# EAGLE design circuit (EAGLE 7.1.0)
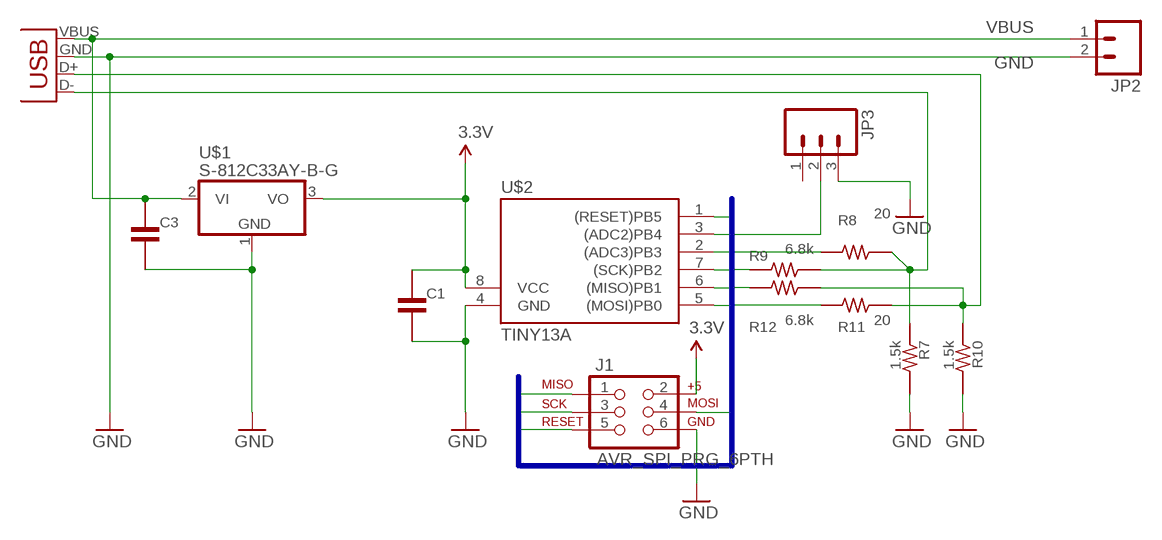
[diagram p0: schematic, sheet 1]

## Parts
C1  C-50V-0302-2.54  [50-0302-2.54]
C3  C-50V-0302-2.54  [50-0302-2.54]
J1  AVR_SPI_PRG_6PTH  [2X3]
JP1  USB-A-H  [USB-A-H]
JP2  M02PTH  [1X02]
JP3  M03PTH  [1X03]
R7  1.5k  R-1/4W-05.08-V  [1/4W-5.08V]
R8  20  R-1/4W-05.08-V  [1/4W-5.08V]
R9  6.8k  R-1/4W-05.08-V  [1/4W-5.08V]
R10  1.5k  R-1/4W-05.08-V  [1/4W-5.08V]
R11  20  R-1/4W-05.08-V  [1/4W-5.08V]
R12  6.8k  R-1/4W-05.08-V  [1/4W-5.08V]
U$1  S-812C33AY-B-G  S-812C  [TO-92]
U$2  TINY13A  TINY138P3  [DIL08]

## Nets
0.6V2: JP1.D-(D+) R7.PAD1 R8.PAD2 R9.PAD2
0.6V3: JP1.D+(D-) R10.PAD1 R11.PAD2 R12.PAD2
3.3V: C1.PAD1 J1.2 U$1.3(VO) U$2.8(VCC)
GND: C1.PAD2 C3.PAD2 J1.6 JP1.GND(VBUS) JP2.2 JP3.3 R7.PAD2 R10.PAD2 U$1.1(GND) U$2.4(GND)
MISO: J1.1 R12.PAD1 U$2.6((MISO)PB1)
MOSI: J1.4 R11.PAD1 U$2.5((MOSI)PB0)
N$1: R8.PAD1 U$2.2((ADC3)PB3)
N$2: JP3.2 U$2.3((ADC2)PB4)
RESET: J1.5 U$2.1((RESET)PB5)
SCK: J1.3 R9.PAD1 U$2.7((SCK)PB2)
VBUS: C3.PAD1 JP1.VBUS(GND) JP2.1 U$1.2(VI)
Unconnected: JP3.1

## Buses
MISO,SCK,RESET,MOSI

## Library data of the parts
C1 C3 = my:C-: CAPACITOR Japanese symbol
J1 = SparkFun-Connectors:AVR_SPI_PRG_6: AVR ISP 6 Pin This is the reduced ISP connector for AVR programming. Common on Arduino. This footprint will take up less PCB space and can be used with a 10-pin to 6-pin adapter such as SKU: BOB-08508
JP1 = SparkFun-Connectors:USB: USB Connectors USB-B-PTH is fully proven SKU : PRT-00139/CONN-08278 USB-miniB is fully proven SKU : PRT-00587 USB-A-PCB is untested. USB-A-H is throughly reviewed, but untested. Spark Fun Electronics SKU : PRT-00437 USB-B-SMT is throughly reviewed, but untested. Needs silkscreen touching up. USB-A-S has not been used/tested USB-MB-H has not been used/tested USB-MICROB has been used. CONN-09505
JP2 = SparkFun-Connectors:M02: Header 2 Standard 2-pin 0.1" header. Use with straight break away headers (SKU : PRT-00116), right angle break away headers (PRT-00553), swiss pins (PRT-00743), machine pins (PRT-00117), and female headers (PRT-00115). Molex polarized connector foot print use with SKU : PRT-08233 with associated crimp pins and housings.
JP3 = SparkFun-Connectors:M03: Header 3 Standard 3-pin 0.1" header. Use with straight break away headers (SKU : PRT-00116), right angle break away headers (PRT-00553), swiss pins (PRT-00743), machine pins (PRT-00117), and female headers (PRT-00115). Molex polarized connector foot print use with SKU : PRT-08232 with associated crimp pins and housings.
R7-R12 = my:R-: RESISTOR Japanese symbol
U$1 = my:S-812C
U$2 = avr-7:TINY13*

## Board
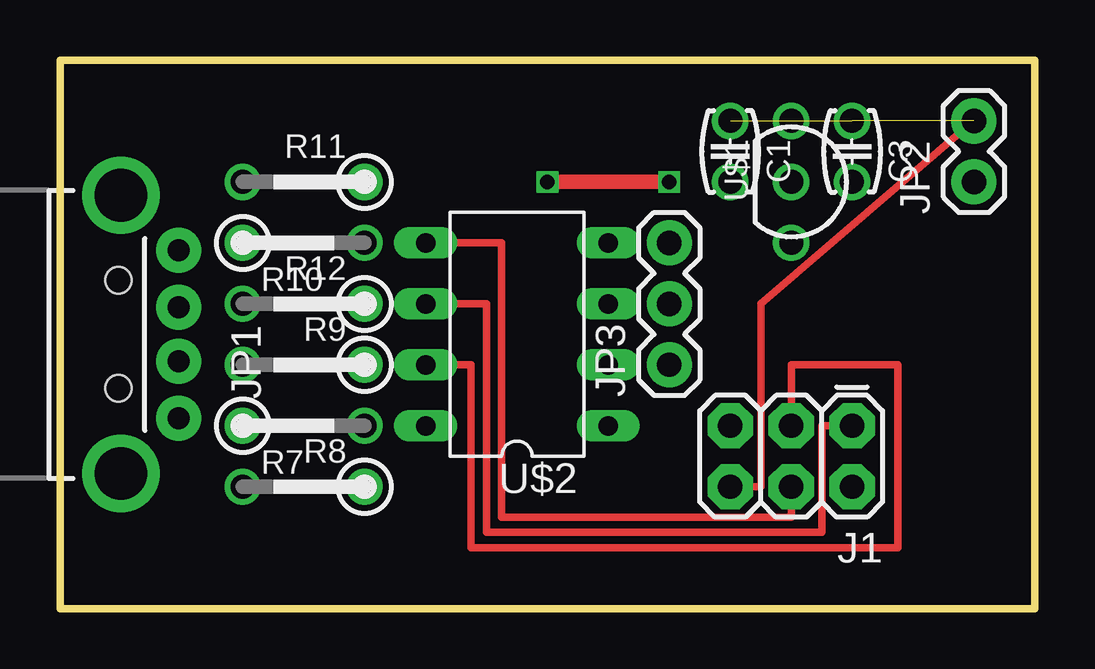
[diagram p1: board, top side]
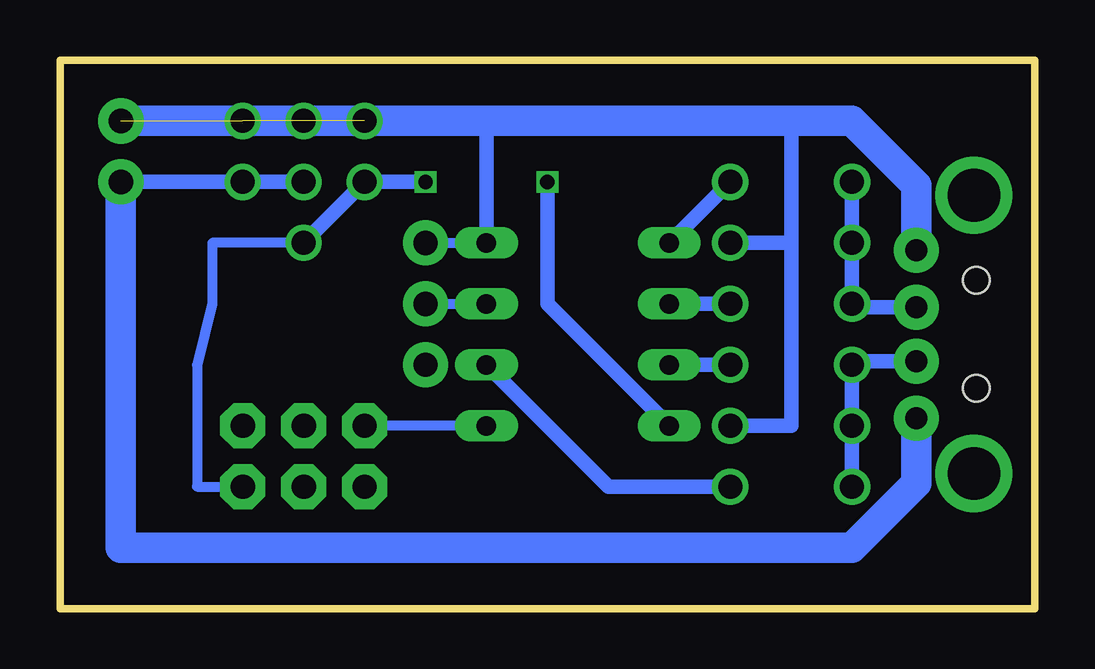
[diagram p2: board, bottom side, seen from below]

Size 40.64 x 22.86 mm. Coordinates in mm from the lower left corner, seen from the top.
Outline: 0,0 40.64,0 40.64,22.86 0,22.86 0,0
Copper layers (1*16): Top 0.035mm / dielectric 1.5mm / Bottom 0.035mm
Design rules "Elecrow_2-layer_eagle_rule": minimum track width 6mil, minimum drill 12mil, track to track 6mil, track to pad 6mil, pad to pad 6mil, via to via 6mil, smd to smd 0mil, copper to edge 10mil, drill to drill 10mil, minimum pad ring 10mil, minimum via ring 6mil, stop-mask expansion 2mil, vias tented up to drill 100mil, thermal gap 10mil

### Footprints (pad centres in the part's own frame; a part is rotated, then mirrored left to right if it is on the bottom)
50-0302-2.54 = drill 1: PAD1 -1.27,0; PAD2 1.27,0
2X3 = drill 1.016 pad 1.88 octagon: 1 0,0; 2 0,2.54; 3 2.54,0; 4 2.54,2.54; 5 5.08,0; 6 5.08,2.54
USB-A-H = drill 0.914 pad 1.88: D+ 2.4,1.127; D- 2.4,-1.127; GND 2.4,3.5; VBUS 2.4,-3.5 | drill 2.2: GND2 0,-5.8; GND3 0,5.8 | hole 1.1: -0.1,2.25; -0.1,-2.25
1X02 = drill 1.016 pad 1.88: 1 0,0; 2 2.54,0
1X03 = drill 1.016 pad 1.88: 1 0,0; 2 2.54,0; 3 5.08,0
1/4W-5.08V = drill 1: PAD1 0,0; PAD2 5.08,0
TO-92 = drill 1: 1 -2.54,0; 2 0,0; 3 2.54,0
DIL08 = drill 0.813 long: 1 -3.81,-3.81; 2 -1.27,-3.81; 3 1.27,-3.81; 4 3.81,-3.81; 5 3.81,3.81; 6 1.27,3.81; 7 -1.27,3.81; 8 -3.81,3.81

### Placement (x,y rotation side)
C1  27.94,19.05 90 top
C3  33.02,19.05 90 top
J1  33.02,7.62 180 top
JP1  2.54,11.43 0 top
JP2  38.1,17.78 90 top
JP3  25.4,10.16 90 top
R7  7.62,7.62 0 top
R8  12.7,5.08 180 top
R9  12.7,10.16 180 top
R10  7.62,15.24 0 top
R11  12.7,17.78 180 top
R12  12.7,12.7 180 top
U$1  30.48,17.78 270 top
U$2  19.05,11.43 90 top

### Tracks (layer width: path | path; a pad name or v marks a point on that pad's centre or on a via)
0.6V2
  Bottom 0.61: R8.PAD2 R7.PAD1 R9.PAD2 7.48,10.3 JP1.D-
0.6V3
  Bottom 0.61: R11.PAD2 R10.PAD1 R12.PAD2 7.48,12.56 JP1.D+
3.3V  (via drill 0.6)
  Top 0.61: v25.4,17.78 v20.32,17.78
  Bottom 0.406: U$1.3 34.29,15.24 34.29,12.7 34.92,10.16 34.92,5.08 J1.2
  Bottom 0.61: U$2.8 20.32,12.7 v20.32,17.78 | U$1.3 C1.PAD1 v25.4,17.78
GND  (via drill 0.6)  (3 unrouted)
  Top 0.305: J1.6 29.21,5.08 29.21,12.7 JP2.2
  Bottom 0.406: JP3.3 U$2.4
  Bottom 0.61: R7.PAD2 10.16,7.62 10.16,15.24 | 10.16,15.24 R10.PAD2 | 10.16,20.32 10.16,15.24 | U$2.4 22.86,20.32
  Bottom 1.27: JP1.GND 4.94,17.64 7.62,20.32 10.16,20.32 22.86,20.32 JP2.2
  other vias: 38.1,20.32
MISO
  Top 0.305: U$2.6 17.78,12.7 17.78,3.17 31.75,3.17 31.75,7.62 J1.1
  Bottom 0.61: R12.PAD1 U$2.6
MOSI
  Top 0.305: U$2.5 18.41,15.24 18.41,3.81 30.48,3.81 J1.4
  Bottom 0.61: R11.PAD1 U$2.5
N$1
  Bottom 0.61: R8.PAD1 17.78,5.08 U$2.2
N$2
  Bottom 0.406: JP3.2 U$2.3
RESET
  Bottom 0.406: U$2.1 J1.5
SCK
  Top 0.305: U$2.7 17.14,10.16 17.14,2.54 34.92,2.54 34.92,10.16 30.48,10.16 J1.3
  Bottom 0.61: R9.PAD1 U$2.7
VBUS
  Bottom 0.61: U$1.2 C3.PAD1 JP2.1
  Bottom 1.27: JP1.VBUS 4.94,5.22 7.62,2.54 38.1,2.54 JP2.1